# EAGLE schematic IOIO Sensors Unrouted (EAGLE 6.3)
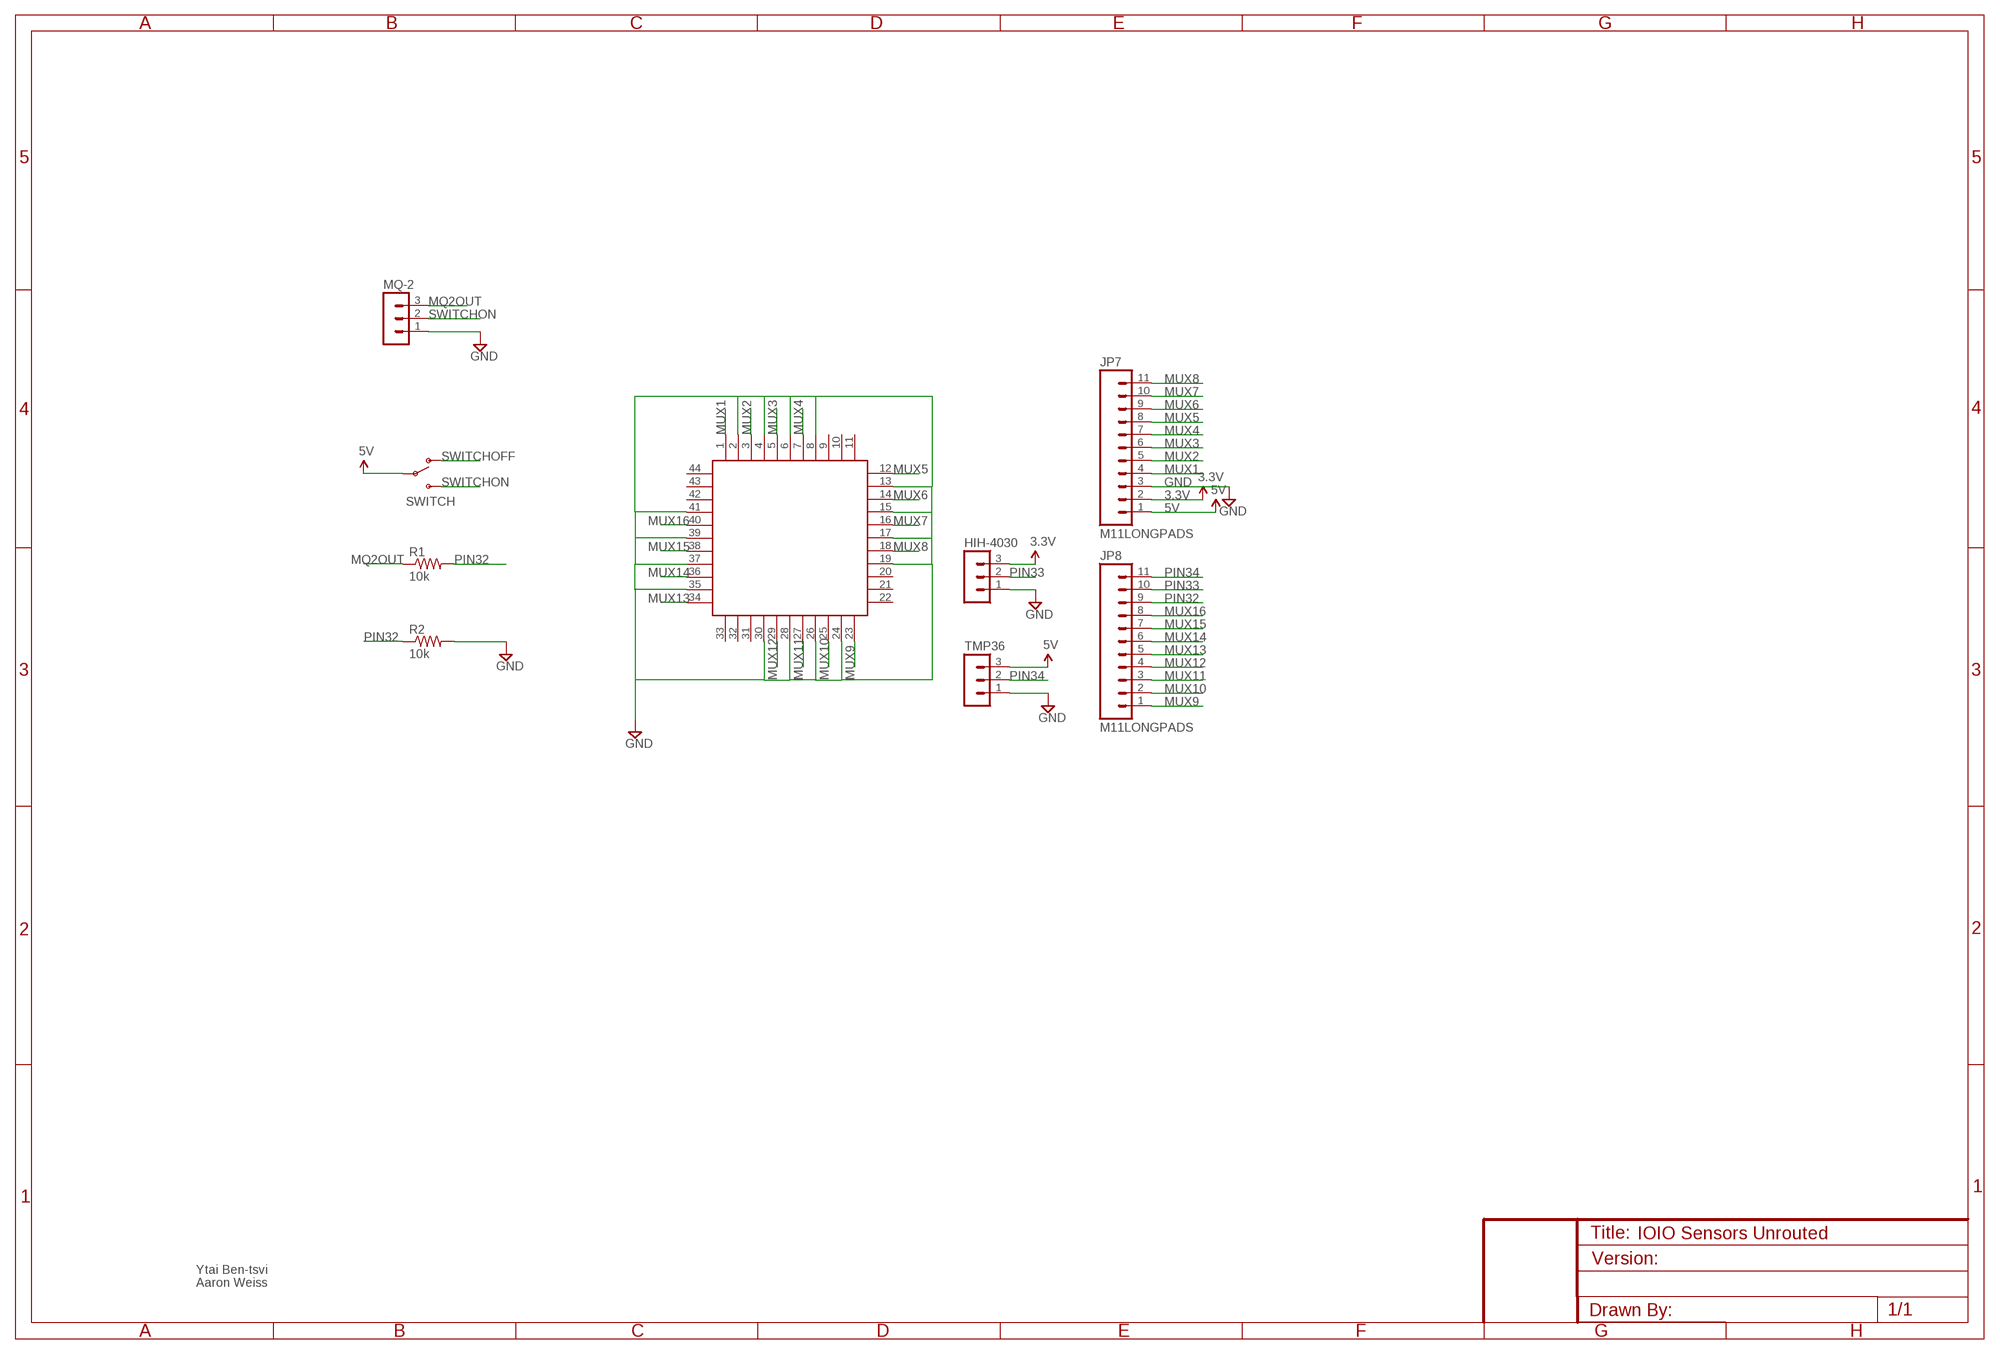
[diagram p0: schematic, sheet 1]

## Parts
HIH-4030  MA03-1  [MA03-1]
JP7  M11LONGPADS  [1X11_LONGPADS]
JP8  M11LONGPADS  [1X11_LONGPADS]
MQ-2  MA03-1  [MA03-1]
R1  10k  R-US_0207/7  [0207/7]
R2  10k  R-US_0207/7  [0207/7]
SWITCH  SWITCH-SPSTPTH_LOCK  [SWITCH-SPDT_LOCK.007S]
TMP36  MA03-1  [MA03-1]
U$4  S44  [S44]

## Nets
3.3V: HIH-4030.3 JP7.2
5V: JP7.1 SWITCH.2(P) TMP36.3
GND: HIH-4030.1 JP7.3 MQ-2.1 R2.2 TMP36.1 U$4.2 U$4.4 U$4.6 U$4.8 U$4.13 U$4.15 U$4.17 U$4.19 U$4.24 U$4.26 U$4.28 U$4.30 U$4.35 U$4.37 U$4.39 U$4.41
MQ2OUT: MQ-2.3 R1.1
MUX1: JP7.4 U$4.1
MUX2: JP7.5 U$4.3
MUX3: JP7.6 U$4.5
MUX4: JP7.7 U$4.7
MUX5: JP7.8 U$4.12
MUX6: JP7.9 U$4.14
MUX7: JP7.10 U$4.16
MUX8: JP7.11 U$4.18
MUX9: JP8.1 U$4.23
MUX10: JP8.2 U$4.25
MUX11: JP8.3 U$4.27
MUX12: JP8.4 U$4.29
MUX13: JP8.5 U$4.34
MUX14: JP8.6 U$4.36
MUX15: JP8.7 U$4.38
MUX16: JP8.8 U$4.40
PIN32: JP8.9 R1.2 R2.1
PIN33: HIH-4030.2 JP8.10
PIN34: JP8.11 TMP36.2
SWITCHOFF: SWITCH.1(O)
SWITCHON: MQ-2.2 SWITCH.3(S)
Unconnected: U$4.9 U$4.10 U$4.11 U$4.20 U$4.21 U$4.22 U$4.31 U$4.32 U$4.33 U$4.42 U$4.43 U$4.44

## Notes on the sheet
- Ytai Ben-tsvi
- Aaron Weiss

## Library data of the parts
HIH-4030 MQ-2 TMP36 = con-lstb:MA03-1: PIN HEADER; OC_FARNELL: unknown; OC_NEWARK: unknown
JP7 JP8 = SparkFun:M11: Header 11 Standard 11-pin 0.1" header. Use with straight break away headers (SKU : PRT-00116), right angle break away headers (PRT-00553), swiss pins (PRT-00743), machine pins (PRT-00117), and female headers (PRT-00115).
R1 R2 = resistor:R-US_: RESISTOR, American symbol
SWITCH = SparkFun:SWITCH-SPST: SPST Switch Simple slide switch. Spark Fun Electronics SKU : COM-00102
U$4 = plcc-socket:S44: 44-pin PLCC through-hole socket